# EAGLE design analog_rng2 (EAGLE 8.1.1)
True Random Number Generator
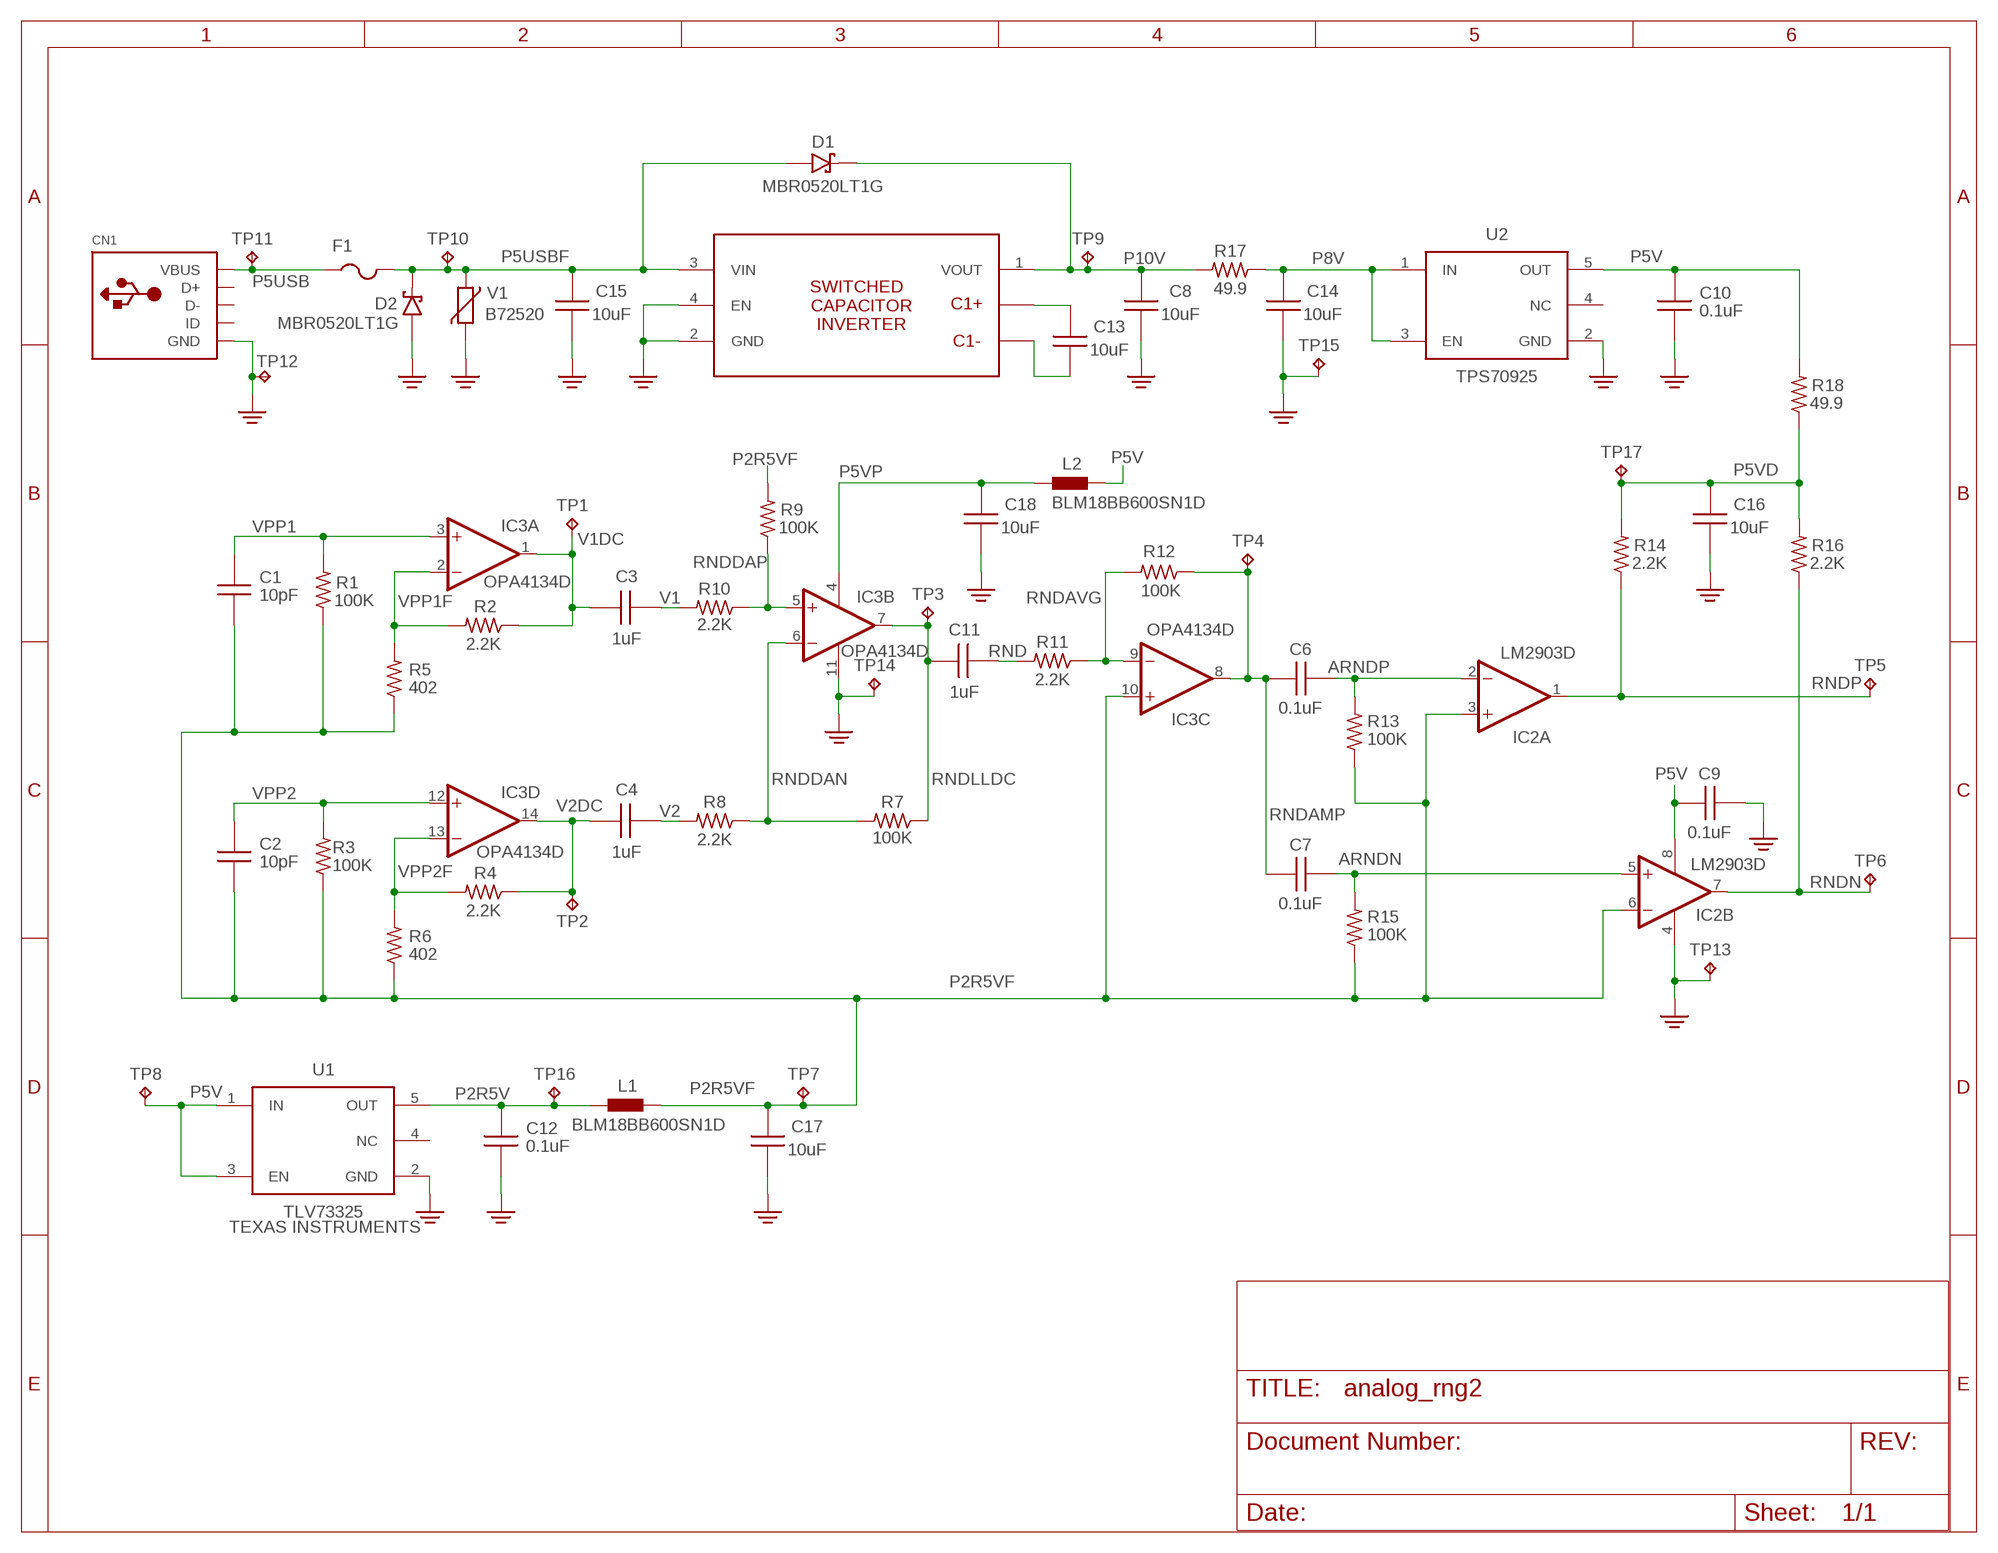
[diagram p0: schematic, sheet 1]

## Parts
C1  10pF  C-USC0603  [C0603]
C2  10pF  C-USC0603  [C0603]
C3  1uF  C-USC1206  [C1206]
C4  1uF  C-USC1206  [C1206]
C6  0.1uF  C-USC0603  [C0603]
C7  0.1uF  C-USC0603  [C0603]
C8  10uF  C-USC1206  [C1206]
C9  0.1uF  C-USC0603  [C0603]
C10  0.1uF  C-USC0603  [C0603]
C11  1uF  C-USC1206  [C1206]
C12  0.1uF  C-USC0603  [C0603]
C13  10uF  C-USC1206  [C1206]
C14  10uF  C-USC1206  [C1206]
C15  10uF  C-USC1206  [C1206]
C16  10uF  C-USC1206  [C1206]
C17  10uF  C-USC1206  [C1206]
C18  10uF  C-USC1206  [C1206]
CN1  USBMINIB  [USB-MINIB]
D1  MBR0520LT1G  MBR0520LT1GSOD-123  [SOD-123]
D2  MBR0520LT1G  MBR0520LT1GSOD-123  [SOD-123]
F1  PTCFUSE-1812  [1812]
IC2  LM2903D  [SO08]
IC3  OPA4134D  [SO14]
L1  BLM18BB600SN1D  BEADR0805  [R0805]
L2  BLM18BB600SN1D  BEADR0805  [R0805]
R1  100K  R-US_R1206  [R1206]
R2  2.2K  R-US_R1206  [R1206]
R3  100K  R-US_R1206  [R1206]
R4  2.2K  R-US_R1206  [R1206]
R5  402  R-US_R1206  [R1206]
R6  402  R-US_R1206  [R1206]
R7  100K  R-US_R1206  [R1206]
R8  2.2K  R-US_R1206  [R1206]
R9  100K  R-US_R1206  [R1206]
R10  2.2K  R-US_R1206  [R1206]
R11  2.2K  R-US_R1206  [R1206]
R12  100K  R-US_R1206  [R1206]
R13  100K  R-US_R1206  [R1206]
R14  2.2K  R-US_R1206  [R1206]
R15  100K  R-US_R1206  [R1206]
R16  2.2K  R-US_R1206  [R1206]
R17  49.9  R-US_R1206  [R1206]
R18  49.9  R-US_R1206  [R1206]
TP1  TPPAD1-20  [P1-20]
TP2  TPPAD1-20  [P1-20]
TP3  TPPAD1-20  [P1-20]
TP4  TPPAD1-20  [P1-20]
TP5  TPPAD1-20  [P1-20]
TP6  TPPAD1-20  [P1-20]
TP7  TPPAD1-20  [P1-20]
TP8  TPPAD1-20  [P1-20]
TP9  TPPAD1-20  [P1-20]
TP10  TPPAD1-20  [P1-20]
TP11  TPPAD1-20  [P1-20]
TP12  TPPAD1-20  [P1-20]
TP13  TPPAD1-20  [P1-20]
TP14  TPPAD1-20  [P1-20]
TP15  TPPAD1-20  [P1-20]
TP16  TPPAD1-20  [P1-20]
TP17  TPPAD1-20  [P1-20]
U1  TLV73325  [SOT23-5]
U2  TPS70925  [SOT23-5]
U23423  LM277625  [SOT23-6]
V1  B72520  VARISTORCN1206  [CT/CN1206]

## Nets
ARNDN: C7.2 IC2.5(B:+IN) R15.2
ARNDP: C6.2 IC2.2(A:-IN) R13.2
N$1: C13.1 U23423.5(C1P)
N$2: C13.2 U23423.6(C1N)
P2R5V: C12.1 L1.1 TP16.TP U1.5(OUT)
P2R5VF: C1.2 C2.2 C17.1 IC2.3(A:+IN) IC2.6(B:-IN) IC3.10(C:+IN) L1.2 R1.1 R3.1 R5.1 R6.1 R9.2 R13.1 R15.1 TP7.TP
P5USB: CN1.VBUS F1.1 TP11.TP
P5USBF: C15.1 D1.A D2.K F1.2 TP10.TP U23423.3(VIN) V1.1
P5V: C9.1 C10.1 IC2.8(P:V+) L2.2 R18.2 TP8.TP U1.1(IN) U1.3(EN) U2.5(OUT)
P5VD: C16.1 R14.2 R16.2 R18.1 TP17.TP
P5VP: C18.1 IC3.4(P:V+) L2.1
P8V: C14.1 R17.1 U2.1(IN) U2.3(EN)
P10V: C8.1 D1.K R17.2 TP9.TP U23423.1(VOUT)
PE: C8.2 C9.2 C10.2 C12.2 C14.2 C15.2 C16.2 C17.2 C18.2 CN1.GND D2.A IC2.4(P:V-) IC3.11(P:V-) TP12.TP TP13.TP TP14.TP TP15.TP U1.2(GND) U2.2(GND) U23423.2(GND) U23423.4(EN) V1.2
RND: C11.2 R11.2
RNDAMP: C6.1 C7.1 IC3.8(C:OUT) R12.1 TP4.TP
RNDAVG: IC3.9(C:-IN) R11.1 R12.2
RNDDAN: IC3.6(B:-IN) R7.2 R8.1
RNDDAP: IC3.5(B:+IN) R9.1 R10.1
RNDLLDC: C11.1 IC3.7(B:OUT) R7.1 TP3.TP
RNDN: IC2.7(B:OUT) R16.1 TP6.TP
RNDP: IC2.1(A:OUT) R14.1 TP5.TP
V1: C3.2 R10.2
V1DC: C3.1 IC3.1(A:OUT) R2.1 TP1.TP
V2: C4.2 R8.2
V2DC: C4.1 IC3.14(D:OUT) R4.1 TP2.TP
VPP1: C1.1 IC3.3(A:+IN) R1.2
VPP1F: IC3.2(A:-IN) R2.2 R5.2
VPP2: C2.1 IC3.12(D:+IN) R3.2
VPP2F: IC3.13(D:-IN) R4.2 R6.2
Unconnected: CN1.D+ CN1.D- CN1.ID U1.4(NC) U2.4(NC)

## Library data of the parts
C1-C4 C6-C18 = vreg_local:C-US: CAPACITOR, American symbol
CN1 = vreg_local:USB: USB Connectors USBMINIB - Surface Mount Female Mini-B USB Connector 4UConnector: 06564 By microbuilder.eu Thru-hole RA Female Mini-B USB Connector 4UConnector: 18732 By ladyada.net
D1 D2 = vreg_local:MBR0520LT1G: Schottky Diode
F1 = vreg_local:PTCFUSE: PTC fuses, resettable thermistors
IC2 = linear:LM2903: COMPARATOR
IC3 = vreg_local:OPA4134: OP Amp, Low Noise Audio; MF: TEXAS INSTRUMENTS; MPN: OPA4134UA/2K5; OC_DIGIKEY: 296-26284-1-ND
L1 L2 = vreg_local:BEAD: Ferrite Bead
R1-R18 = resistor:R-US_: RESISTOR, American symbol
TP1-TP17 = testpad:TP: Test pad
U1 = vreg_local:TLV733: Voltage Regulator 2.5 V, LDO, 300 mA Source: http://www.ti.com/lit/ds/symlink/tlv733p.pdf; MF: TEXAS INSTRUMENTS; MPN: TLV73325PDBVT; OC_DIGIKEY: 296-38491-1-ND
U2 = vreg_local:TPS709: Voltage Regulator 5 V, LDO, 200 mA Source: http://www.ti.com/lit/ds/symlink/tps709.pdf; MF: TEXAS INSTRUMENTS; MPN: TLV70950DBVR; OC_DIGIKEY: 296-35484-1-ND
U23423 = vreg_local:LM2776: Switched Capacitor Inverter 2.7 to 5.5 V, 200 mA Source: LM2776 datasheet <http://www.ti.com/lit/ds/symlink/lm2776.pdf>; MF: TEXAS INSTRUMENTS; MPN: LM2776DBVR; OC_DIGIKEY: 296-43957-1-ND
V1 = vreg_local:VARISTOR: VARISTOR

## Board
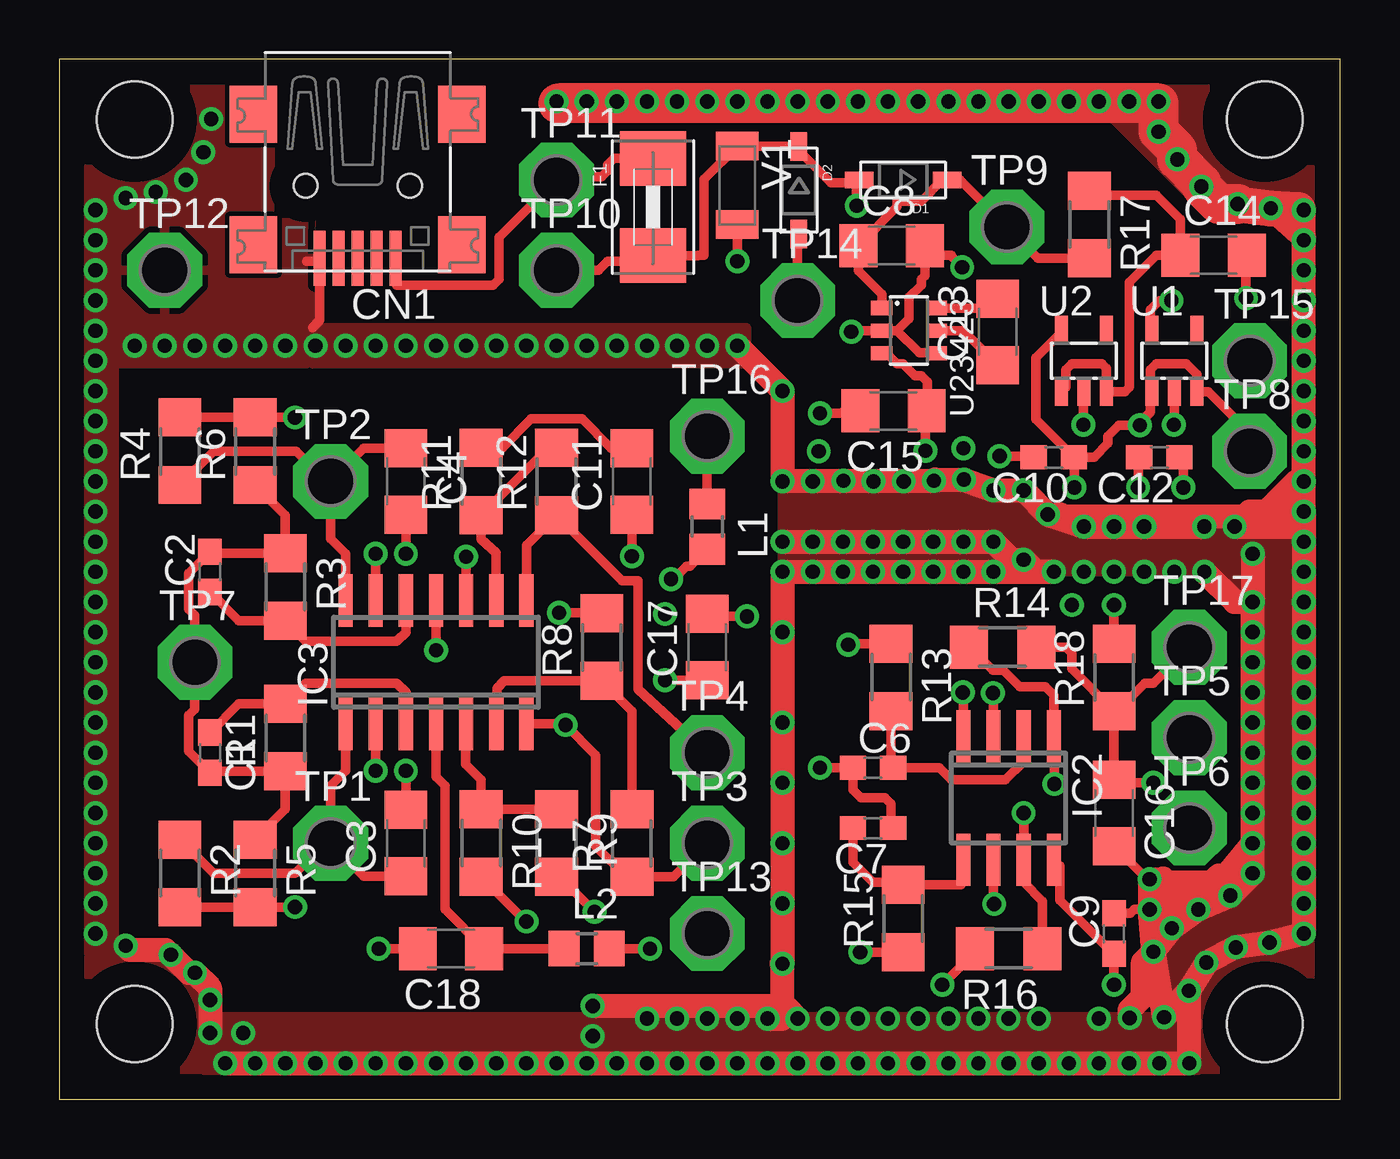
[diagram p1: board, top side]
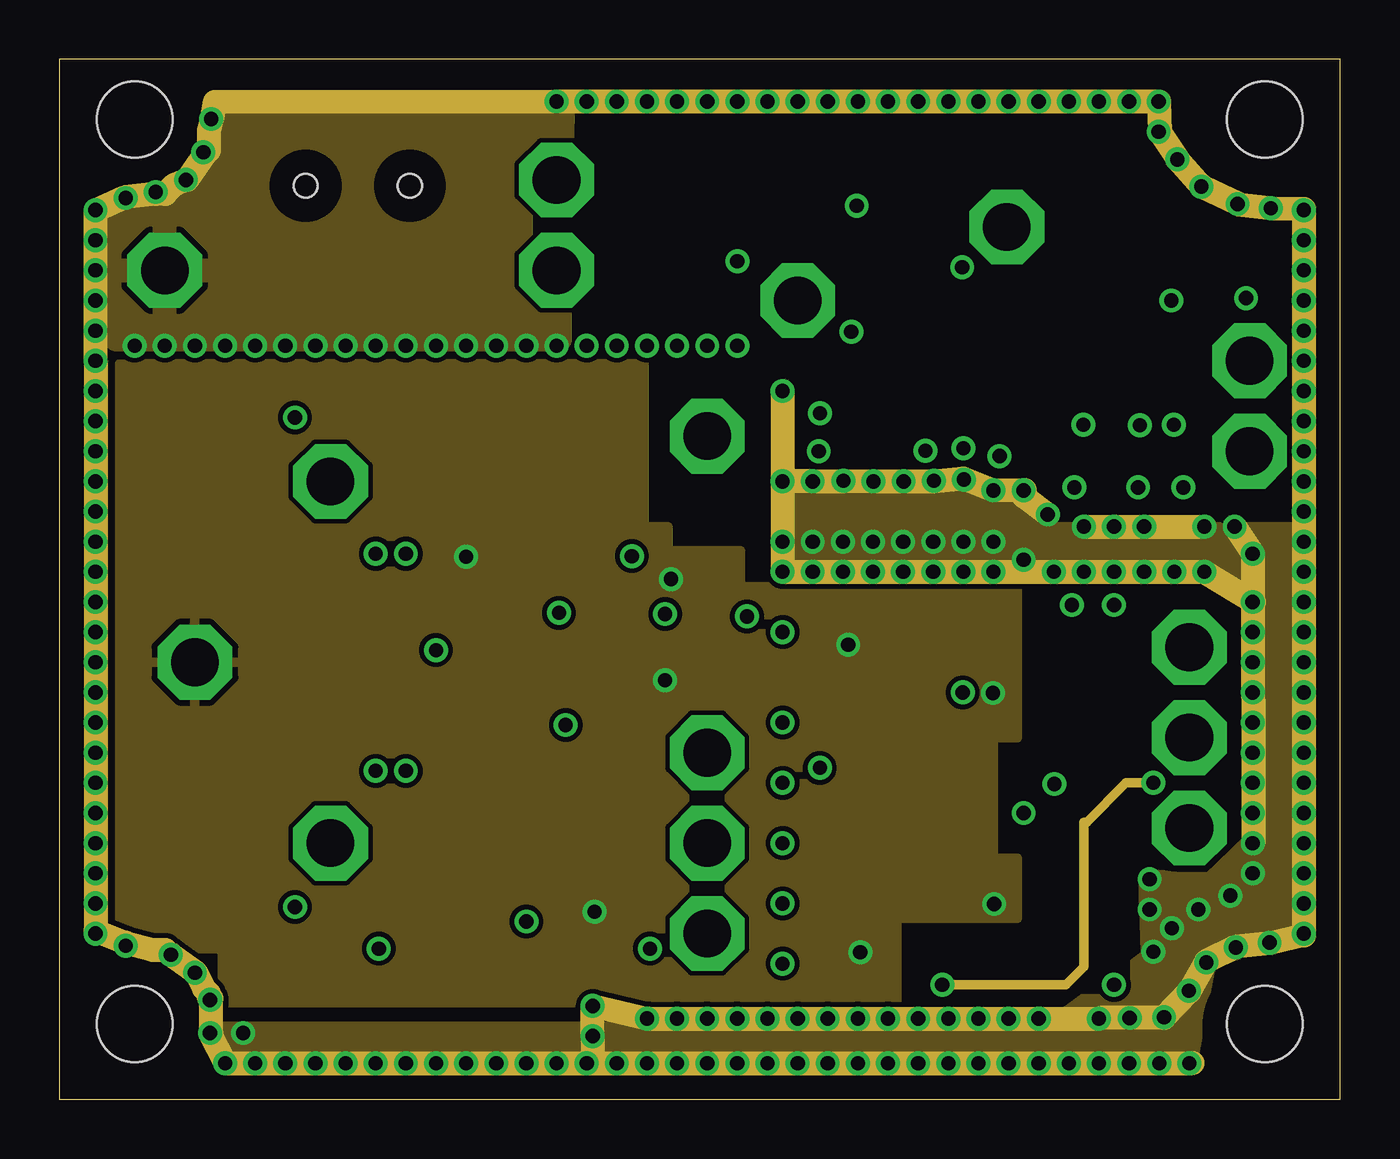
[diagram p2: board, inner layer Route2]
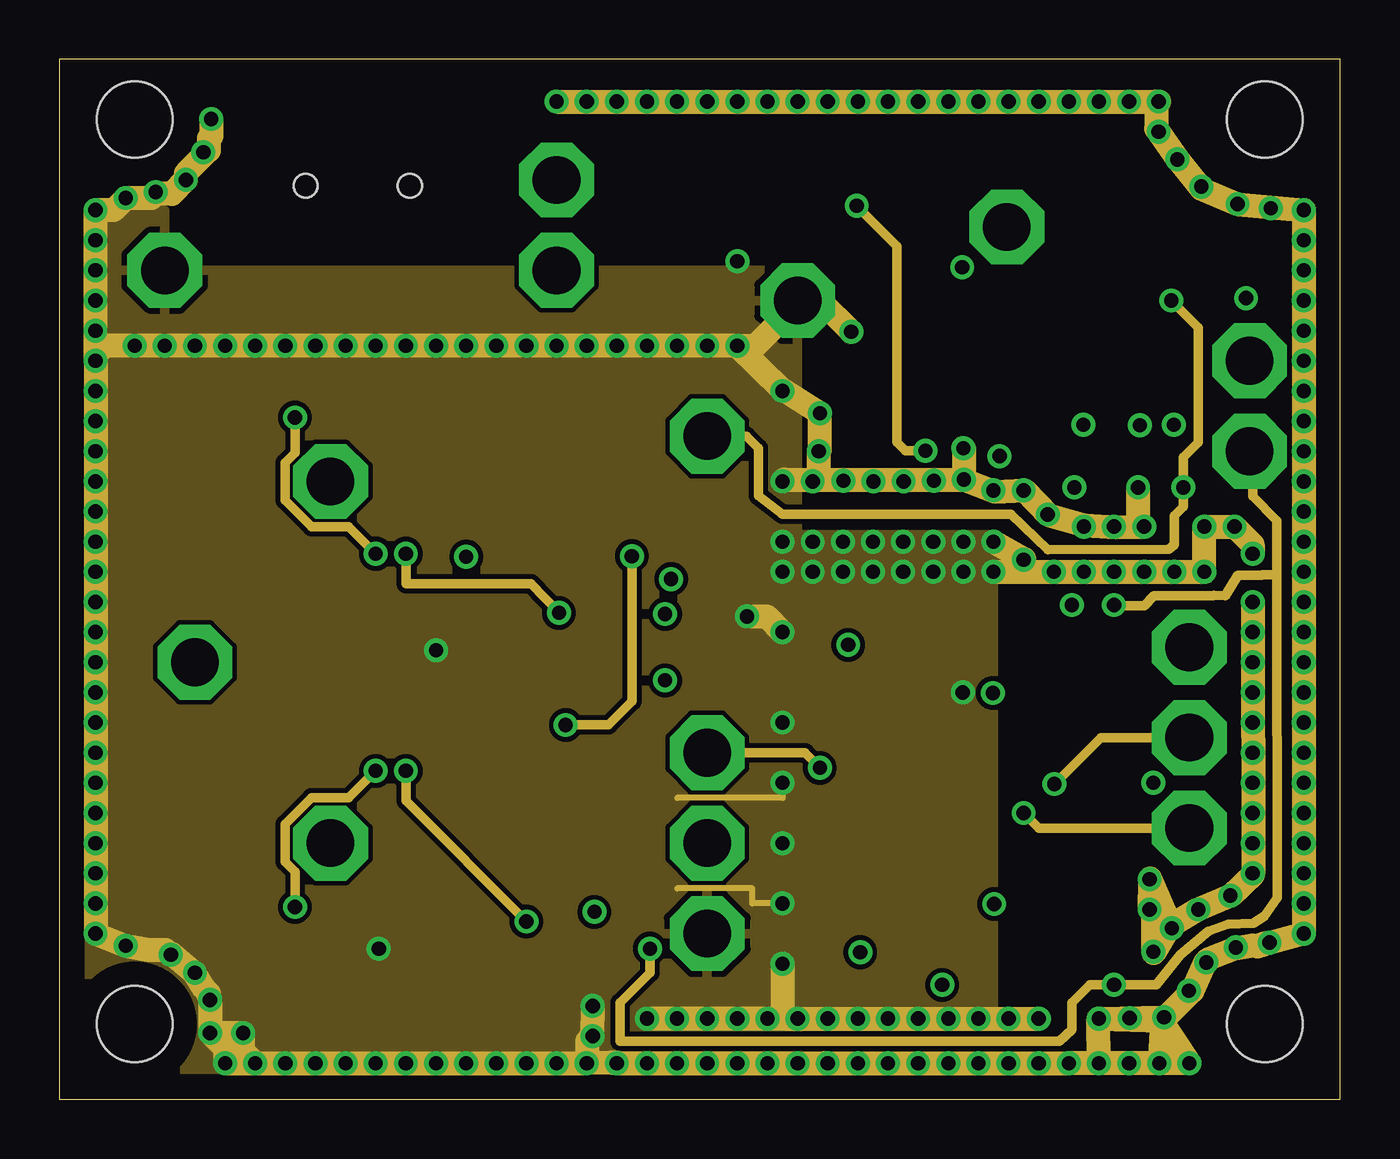
[diagram p3: board, inner layer Route15]
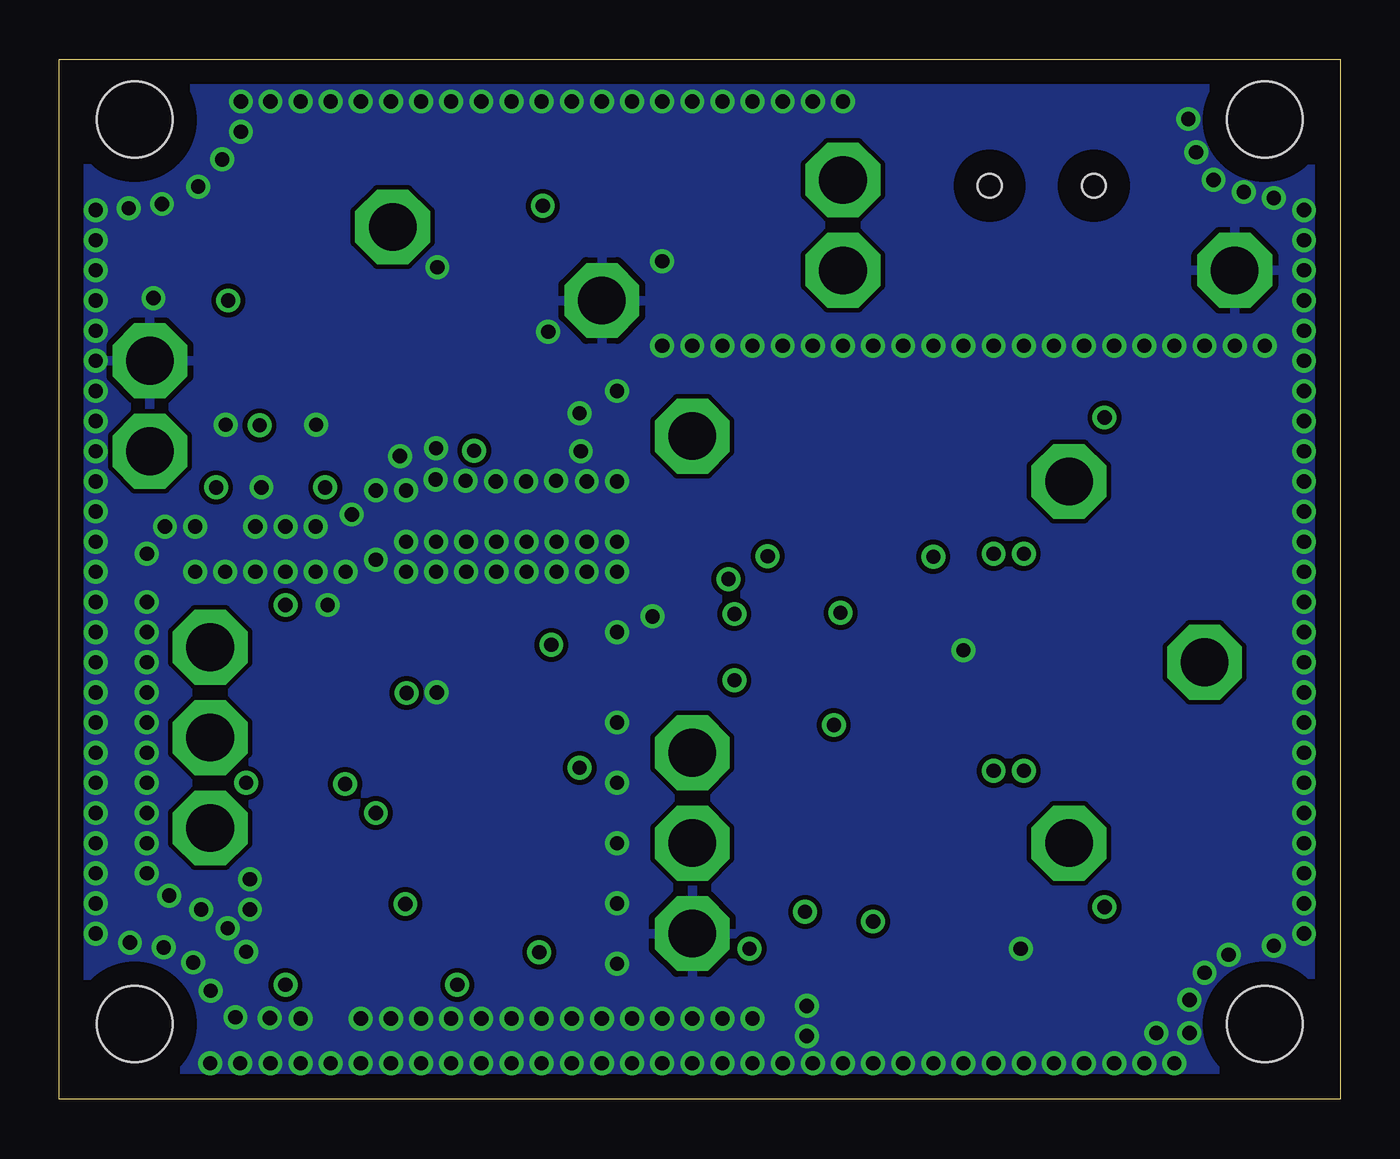
[diagram p4: board, bottom side, seen from below]

Size 53.98 x 43.82 mm. Coordinates in mm from the lower left corner, seen from the top.
Outline: 0,0 53.98,0 53.98,43.81 0,43.81 0,0
Copper layers (1+2*15+16): Top 0.035mm / dielectric 0.21mm / Route2 0.035mm / dielectric 40mil / Route15 0.035mm / dielectric 0.21mm / Bottom 0.035mm
Design rules "default *": minimum track width 10mil, minimum drill 24mil, track to track 8mil, track to pad 8mil, pad to pad 8mil, via to via 8mil, smd to smd 8mil, copper to edge 40mil, drill to drill 8mil, minimum pad ring 10mil, minimum via ring 8mil, stop-mask expansion 4mil, vias tented up to drill 0mil, thermal gap 10mil
Holes 3.2 mm at 3.17,3.17 3.17,41.27 50.8,41.27 50.8,3.17

### Footprints (pad centres in the part's own frame; a part is rotated, then mirrored left to right if it is on the bottom)
C0603 = smd 1.1 x 1: 1 -0.85,0; 2 0.85,0
C1206 = smd 1.6 x 1.8: 1 -1.4,0; 2 1.4,0
USB-MINIB = smd 0.5 x 2.308: D+ -0.8,4.064; D- 0,4.064; GND 1.6,4.064; ID 0.8,4.064; VBUS -1.6,4.064 | smd 2 x 2.4: GND1 -4.4,-2; GND2 -4.4,3.5; GND3 4.4,3.5; GND4 4.4,-2 | hole 1: -2.2,1; 2.2,1
SOD-123 = smd 1.2 x 0.7: A 1.85,0; K -1.85,0
1812 = smd 2.286 x 2.794: 1 -2.046,0; 2 2.046,0
SO08 = smd 0.6 x 2.2: 1 -1.905,-2.6; 2 -0.635,-2.6; 3 0.635,-2.6; 4 1.905,-2.6; 5 1.905,2.6; 6 0.635,2.6; 7 -0.635,2.6; 8 -1.905,2.6
SO14 = smd 0.6 x 2.2: 1 -3.81,-2.6; 2 -2.54,-2.6; 3 -1.27,-2.6; 4 0,-2.6; 5 1.27,-2.6; 6 2.54,-2.6; 7 3.81,-2.6; 8 3.81,2.6; 9 2.54,2.6; 10 1.27,2.6; 11 0,2.6; 12 -1.27,2.6; 13 -2.54,2.6; 14 -3.81,2.6
R0805 = smd 1.3 x 1.5: 1 -0.95,0; 2 0.95,0
R1206 = smd 1.6 x 1.803: 1 -1.422,0; 2 1.422,0
P1-20 = drill 2.007 pad 3.15 octagon: TP 0,0
SOT23-5 = smd 0.55 x 1.2: 1 -0.95,-1.3; 2 0,-1.3; 3 0.95,-1.3; 4 0.95,1.3; 5 -0.95,1.3
SOT23-6 = smd 0.6 x 0.9: 1 -0.95,-1.15; 2 0,-1.15; 3 0.95,-1.15; 4 0.95,1.15; 5 0,1.15; 6 -0.95,1.15
CT/CN1206 = smd 1.2 x 1.8: 1 -1.65,0; 2 1.65,0

### Placement (x,y rotation side)
C1  6.35,14.61 270 top
C2  6.35,22.23 90 top
C3  14.61,10.79 90 top
C4  14.61,26.04 270 top
C6  34.29,13.97 0 top
C7  34.29,11.43 180 top
C8  35.08,35.97 0 top
C9  44.45,6.99 90 top
C10  41.91,27.05 180 top
C11  24.13,26.04 90 top
C12  46.35,27.05 180 top
C13  39.55,32.33 90 top
C14  48.64,35.56 0 top
C15  35.15,29.01 180 top
C16  44.45,12.06 270 top
C17  27.3,19.05 90 top
C18  16.51,6.35 180 top
CN1  12.57,39.5 180 top
D1  35.56,38.73 180 top
D2  31.17,38.3 270 top
F1  25.02,37.59 270 top
IC2  40.01,12.7 180 top
IC3  15.88,18.41 0 top
L1  27.3,24.13 270 top
L2  22.23,6.35 0 top
R1  9.53,15.24 90 top
R2  5.08,9.53 270 top
R3  9.53,21.59 270 top
R4  5.08,27.3 90 top
R5  8.26,9.53 270 top
R6  8.26,27.3 90 top
R7  24.13,10.79 90 top
R8  22.86,19.05 90 top
R9  20.95,10.79 270 top
R10  17.78,10.79 270 top
R11  17.78,26.04 90 top
R12  20.95,26.04 90 top
R13  35.05,17.78 270 top
R14  39.75,19.05 0 top
R15  35.56,7.62 90 top
R16  40.01,6.35 180 top
R17  43.41,36.86 270 top
R18  44.45,17.78 90 top
TP1  11.43,10.79 0 top
TP2  11.43,26.04 0 top
TP3  27.3,10.79 0 top
TP4  27.3,14.61 0 top
TP5  47.62,15.24 0 top
TP6  47.62,11.43 0 top
TP7  5.71,18.41 0 top
TP8  50.16,27.3 0 top
TP9  39.93,36.75 0 top
TP10  20.95,34.92 0 top
TP11  20.95,38.73 0 top
TP12  4.45,34.92 0 top
TP13  27.3,6.99 0 top
TP14  31.11,33.66 0 top
TP15  50.16,31.11 0 top
TP16  27.3,27.94 0 top
TP17  47.62,19.05 0 top
U1  46.99,31.11 0 top
U2  43.18,31.11 0 top
U23423  35.81,32.38 270 top
V1  28.57,38.51 270 top

### Tracks (layer width: path | path; a pad name or v marks a point on that pad's centre or on a via)
ARNDN
  Top 0.406: C7.2 33.44,9.99 34.29,9.14 35.46,9.14 R15.2 38,9.04 38.1,9.14 IC2.5
ARNDP
  Top 0.406: R13.2 35.05,13.97 C6.2 37.08,13.97 37.59,13.46 39.88,13.46 40.64,14.22 IC2.2
N$1
  Top 0.406: U23423.5 38.1,32.38 C13.1
N$2
  Top 0.406: U23423.6 39.15,33.34 C13.2
N$173  (via drill 0.6)
  other vias: 25.53,20.45
P2R5V  (via drill 0.6)
  Top 0.406: U1.5 45.97,32.48 45.97,33.27 46.35,33.66 v46.86,33.66 | C12.1 47.37,26.89 v47.37,25.78 | TP16.TP L1.1
  Route15 0.406: v46.86,33.66 48.01,32.51 48.01,27.69 47.37,27.05 v47.37,25.78 47.37,24.97 46.99,24.59 46.99,23.37 46.76,23.18 41.66,23.16 40.11,24.66 30.48,24.66 29.46,25.42 29.46,27.43 28.96,27.94 TP16.TP
P2R5VF  (via drill 0.6)
  Top 0.406: R6.1 9.53,24.61 R3.1 6.41,23.01 C2.2 5.44,22.17 5.44,20.66 5.71,20.39 TP7.TP 5.71,16.45 5.44,16.17 5.44,14.66 C1.2 6.41,13.82 R1.1 9.53,12.22 R5.1 | IC3.10 v17.14,22.86 | IC2.3 39.37,17.09 v39.34,17.12 | R13.1 33.3,19.2 v33.25,19.15 | IC2.6 39.37,8.26 v39.4,8.23 | R15.1 v33.76,6.2 | v33.76,6.2 | L1.2 26.58,22.45 26.44,22.45 25.91,21.92 v25.78,21.92 | v22.55,7.9 21.08,9.37 R9.2 | C17.1 v25.53,17.65
  pour Route2: 25.65,23.11 28.7,23.11 28.7,21.59 40.39,21.59 40.39,15.24 39.37,15.24 39.37,10.16 40.39,10.16 40.39,7.62 35.31,7.62 35.31,4.06 6.86,4.06 6.86,6.35 2.54,6.35 2.54,28.96 2.54,30.99 24.64,30.99 24.64,24.13 25.65,24.13
P5USB
  Top 0.406: CN1.VBUS 14.22,35.69 14.22,34.29 18.29,34.29 18.54,34.54 18.54,36.32 TP11.TP 21.08,38.86 22.86,38.86 23.11,39.12 23.11,39.37 23.38,39.64 F1.1
P5USBF  (via drill 0.6)
  Top 0.406: TP10.TP 22.73,34.92 23.11,35.31 24.78,35.31 F1.2 26.91,35.55 26.92,35.56 27.18,35.56 27.18,38.76 V1.1 D2.K 31.17,39.95 32.51,38.61 33.58,38.61 D1.A 33.6,38.63 v33.6,37.64 | U23423.3 34.86,31.43 35.31,30.99 35.56,30.99 36.07,30.48 36.32,30.48 36.58,30.23 36.58,29.03 C15.1 36.5,28.95 v36.5,27.33
  Route15 0.406: v33.6,37.64 35.31,35.94 35.31,27.69 35.66,27.33 v36.5,27.33
P5V  (via drill 0.6)
  Top 0.406: C10.1 41.15,28.66 41.15,31.24 42.23,32.32 U2.5 | C10.1 42.77,27.04 v42.77,25.78 | C10.1 42.89,26.92 42.93,26.92 | C10.1 43.61,27.05 44.2,27.64 44.2,27.94 44.65,28.4 v45.54,28.4 45.54,28.52 45.97,28.96 45.97,29.75 U1.1 45.97,29.82 45.97,30.73 46.23,30.99 47.5,30.99 47.94,30.55 U1.3 48.42,29.82 50.16,28.07 TP8.TP 50.29,27.18 | L2.2 v24.89,6.35 | v44.45,4.83 C9.1 44.41,6.13 42.16,8.38 42.16,9.85 IC2.8 | R18.2 v44.45,20.83
  Route15 0.406: TP8.TP 50.29,27.18 50.29,25.4 51.31,24.38 51.31,22.1 | 51.31,22.1 51.33,8.48 50.79,7.72 50.31,7.41 49.26,7.39 48.42,7.09 47.24,6.1 46.23,4.83 v44.45,4.83 43.43,4.83 42.67,4.06 42.67,2.94 42.14,2.46 23.62,2.46 23.62,4.06 24.89,5.33 v24.89,6.35 | v44.45,20.83 44.48,20.8 45.72,20.8 46.13,21.21 48.64,21.21 48.66,21.23 49.15,21.21 49.66,22.08 50.67,22.08 50.69,22.1 51.31,22.1
P5VD  (via drill 0.6)
  Top 0.406: R14.2 42.42,19.05 42.67,18.8 42.67,18.14 R18.1 | R18.1 C16.1 44.58,13.34 v46.1,13.34 | R18.1 44.58,16.36 45.74,17.53 46.1,17.53 TP17.TP | v37.21,4.83 38.58,6.2 R16.2
  Route2 0.406: v37.21,4.83 42.42,4.83 43.18,5.59 43.18,11.68 43.31,11.68 44.96,13.34 v46.1,13.34
P5VP
  Top 0.406: L2.1 C18.1 16.26,8 16.26,13.21 15.88,13.59 IC3.4
P8V
  Top 0.406: R17.1 43.59,38.1 46.23,38.1 47.24,37.08 47.24,36.83 C14.1 46.23,35.56 45.09,34.42 45.09,30 44.9,29.82 U2.3 44.13,30.8 43.94,30.99 42.67,30.99 42.42,30.73 42.42,30 U2.1
P10V
  Top 0.406: U23423.1 34.66,33.92 33.68,34.9 C8.1 35.31,37.59 35.31,37.85 36.32,37.85 37.21,38.73 D1.K 37.95,38.73 TP9.TP 41.25,35.43 R17.2
PE  (via drill 0.6)
  Top 0.406: 35.31,32.38 U23423.2 33.43,32.38 v33.38,32.33 | 35.31,32.38 36.25,31.45 36.95,31.45 U23423.4 | 35.31,32.38 35.81,32.89 35.81,33.78 36.32,34.29 36.32,34.54 36.48,34.7 C8.2 | V1.2 v28.57,35.31 | C15.2 33.1,29.01 32.99,28.91 v32.05,28.91 | C10.2 41.01,27.1 v39.62,27.1 | C12.2 45.48,27.03 v45.47,25.78 | U2.2 43.16,29.79 v43.16,28.42 | v46.97,28.42 46.99,28.45 U1.2 | 10.41,35.31 10.85,35.31 CN1.GND 10.97,32.82 10.67,32.51 | C8.2 36.63,35.81 | v38.05,35.05 37.59,35.51 37.59,35.56 37.08,35.56 36.68,35.97 C8.2 | D2.A 31.11,36.4 TP14.TP | IC3.11 v15.88,18.92 | IC2.4 38.1,17.12 v38.08,17.14 | C9.2 45.15,7.83 45.31,8 v45.95,8 | C16.2 45.84,9.27 v45.95,9.27 | C17.2 27.41,20.34 v28.98,20.34 | C14.2 50.01,35.53 v50.01,33.76 | C18.2 v13.46,6.35
  Top 1.016: v29.84,3.4 29.84,3.38 30.45,3.38 30.45,5.71 v30.48,5.71 v30.48,13.34 v30.48,15.88 v30.48,19.68 v30.48,22.23 v39.37,22.23 v41.91,22.23 41.15,22.23 v40.64,22.73 40.13,22.73 v39.37,23.5 v30.48,23.5 | v52.45,24.77 52.45,36.3 | v52.45,24.77 52.45,24.13 | 52.45,36.3 v52.45,37.47 | 52.45,24.13 v52.45,6.99 v51,6.6 v49.58,6.4 v48.34,5.77 v47.6,4.57 | v47.6,4.57 v46.56,3.45 v46.1,6.22 | v6.99,1.52 v31.11,1.52 v47.62,1.52 47.62,4.55 v47.6,4.57 | v2.79,6.48 2.97,6.3 4.47,6.3 4.67,6.1 v4.7,6.1 5.46,5.33 v5.71,5.33 6.35,4.7 v6.35,4.19 v6.35,2.79 | v48.26,22.23 49.53,20.95 v50.29,20.95 | 30.5,26.06 v30.48,26.04 | 30.5,26.06 v36.85,26.06 36.91,26.11 v38.12,26.11 v39.37,25.65 v40.64,25.65 v41.66,24.64 | v48.26,24.13 v45.72,24.13 v43.18,24.13 v41.66,24.64 | v50.29,22.99 v50.29,20.95 | v20.95,42.04 v46.33,42.04 | 30.5,26.06 30.48,26.09 v30.48,29.84 v28.57,31.75 | v50.29,9.53 v50.29,20.95 | v50.29,9.53 v49.35,8.59 v48.01,8 | v48.01,8 v46.89,7.21 | v46.1,6.22 v46.89,7.21 | v46.1,6.22 v45.95,8 | v46.89,7.21 v45.95,8 | v45.95,9.27 v45.95,8 | 50.24,24.13 v49.53,24.13 50.16,24.77 v52.45,24.77 | 50.24,24.13 52.45,24.13 | v45.95,8 v48.01,8 | v45.95,9.27 v48.01,8 | v45.95,9.27 46.52,9.3 46.68,9.14 48.57,9.14 48.87,9.44 v50.29,9.53 | v50.29,10.79 v48.01,8 | v51.05,37.54 52.45,36.3 | v52.45,26.04 52.15,26.04 50.24,24.13 | v41.66,24.64 42.2,24.64 42.27,24.57 52.25,24.57 v52.45,24.77 | v45.11,3.43 45.11,3.77 45.66,4.32 45.66,5.79 v46.1,6.22 | v22.48,3.94 30.35,3.94 30.48,3.81 30.71,3.81 v31.11,3.4
  Top 1.524: v49.66,37.72 v51.05,37.54 52.2,37.48
  Top 1.676: v49.66,37.72 48.87,37.72 v48.13,38.46 48.13,38.58 v47.12,39.6 47.12,39.98 v46.33,40.77 46.33,41.96 21.03,41.96
  Route2 1.016: 7.01,1.52 v6.99,1.52 | 7.01,1.52 47.75,1.52 | 22.48,1.57 v22.48,2.67 v22.48,3.94 24.79,3.4 41.3,3.4 | v52.45,37.47 52.46,34.22 52.46,6.91 51.03,6.58 49.58,6.43 48.34,5.82 47.62,4.55 46.56,3.43 43.87,3.43 | 46.35,42.04 v20.95,42.04 6.55,42.01 6.43,41.3 6.3,40.75 | v46.33,42.04 46.38,40.77 46.38,40.74 | 46.38,40.74 47.14,39.6 v47.12,39.6 48.11,38.48 48.18,38.46 49.66,37.74 v49.66,37.72 51.13,37.54 52.46,37.52 | v30.48,26.04 v31.75,26.04 33.02,26.04 | v33.05,26.06 34.29,26.04 36.83,26.04 38.1,26.16 v39.37,25.65 40.69,25.68 40.64,25.4 41.68,24.64 | v48.26,24.13 44.48,24.13 v44.45,24.13 v43.18,24.13 | v6.4,41.3 6.3,40.83 6.3,40.75 | v6.35,4.19 6.3,4.29 6.3,4.47 6.1,4.67 5.74,5.36 4.72,6.1 4.65,6.12 4.47,6.3 3.95,6.3 2.79,6.6 1.52,7.11 v1.52,31.11 1.52,37.44 2.77,38 4.06,38.15 4.47,38.15 4.85,38.53 5.38,38.73 6.15,39.83 6.3,39.98 6.3,40.75 | 7.01,1.52 v6.35,2.79 6.4,2.79 6.4,4.24 | 46.38,40.74 46.35,40.74 | v30.48,29.84 v30.48,26.04 | v30.48,26.04 v30.48,22.23 v41.91,22.23 v48.26,22.23 50.34,20.95 | v49.53,24.13 v50.29,22.99 50.32,10.77 | v41.27,3.4 43.84,3.4
  Route15 0.254: v30.48,13.34 30.48,12.7 26.04,12.7 | v30.48,8.26 29.21,8.26 29.21,8.89 26.04,8.89
  Route15 1.016: v20.95,42.04 46.23,42.04 | 46.35,42.04 46.23,42.04 | 46.23,42.04 46.23,40.89 47.12,39.62 48.13,38.35 v49.66,37.72 v52.45,37.47 52.46,37.19 52.46,30.99 v52.45,29.84 v52.45,6.99 51.05,6.6 | v51,6.6 50.77,6.56 50.71,6.51 50.59,6.5 50.49,6.44 50.29,6.48 49.53,6.35 48.45,5.92 48.3,5.79 47.75,4.57 46.48,3.3 v43.81,3.4 | 46.35,3.43 v47.62,1.52 v42.55,1.52 | 46.48,3.43 v46.35,1.52 | 22.1,1.52 v6.99,1.52 6.99,2.16 v6.35,2.79 | v23.5,1.52 32.26,1.52 | v22.23,1.52 23.25,1.54 23.5,1.54 | 30.61,3.4 v24.77,3.4 | 30.61,3.4 v41.27,3.4 | v22.48,3.94 22.45,2.67 22.25,2.46 22.25,1.52 | v6.4,41.3 6.4,40.59 6.3,40.49 6.3,39.98 5.33,39.02 v5.33,38.73 4.75,38.15 4.06,38.15 3.89,37.97 v2.79,37.97 2.29,37.47 v1.52,37.47 v1.52,31.11 | v1.52,31.11 v1.52,6.99 v2.79,6.48 3.77,6.3 4.47,6.3 4.62,6.14 4.75,6.12 5.71,5.31 6.11,4.66 6.3,4.47 6.3,4.34 6.38,4.22 | v6.35,4.19 v6.35,2.79 | v6.35,2.79 v7.75,2.79 7.75,2.03 v8.26,1.52 | v33.38,32.33 32.05,33.66 TP14.TP 31.11,33.53 29.34,31.75 v28.57,31.75 v3.17,31.75 1.91,31.75 1.52,31.37 v1.52,31.11 | v30.48,26.04 30.56,26.11 v38.12,26.11 | v38.1,27.43 38.12,27.41 v38.12,26.11 | v31.75,26.04 32,26.29 v32,27.3 32.05,27.36 v32.05,28.91 30.56,29.84 30.48,29.87 28.55,31.75 | v45.47,25.78 45.47,24.38 v45.72,24.13 44.53,24.11 43.2,24.18 41.71,24.61 40.69,25.65 39.42,25.6 v38.12,26.11 | v45.72,22.23 v46.99,22.23 v48.26,22.23 v48.26,24.13 v49.53,24.13 50.29,23.37 v50.29,22.99 | v46.1,6.22 46.1,7.87 45.97,8 | v32.38,1.52 v42.55,1.52 | v28.98,20.34 29.82,20.34 v30.48,19.68 | v30.48,5.71 30.48,3.53 30.61,3.4 | v50.29,20.95 50.32,9.47 49.38,8.59 47.93,7.98 46.79,7.26 46.13,6.17
  Route15 1.016: v45.95,8 45.97,9.27 | v46.89,7.21 45.97,9.3 | v43.81,1.52 43.79,3.4 v46.56,3.45 | v39.37,22.23 41.25,22.23 41.26,22.22 v45.72,22.22 | v39.37,23.5 40.66,22.76
  other vias: 4.06,38.23 1.52,36.2 1.52,34.92 1.52,33.66 1.52,32.38 5.71,31.75 4.45,31.75 6.99,31.75 8.26,31.75 9.53,31.75 10.79,31.75 12.06,31.75 13.34,31.75 14.61,31.75 15.88,31.75 17.14,31.75 18.41,31.75 19.68,31.75 20.95,31.75 22.23,31.75 23.5,31.75 24.77,31.75 26.04,31.75 27.3,31.75 1.52,29.84 1.52,28.57 1.52,27.3 1.52,26.04 1.52,24.77 1.52,23.5 1.52,22.23 1.52,20.95 1.52,19.68 1.52,18.41 1.52,17.14 1.52,15.88 1.52,14.61 1.52,13.34 1.52,12.06 1.52,10.79 1.52,9.53 1.52,8.26 6.07,39.9 22.23,42.04 23.5,42.04 24.77,42.04 26.04,42.04 27.3,42.04 28.57,42.04 29.84,42.04 31.11,42.04 32.38,42.04 33.66,42.04 34.92,42.04 36.2,42.04 37.47,42.04 38.73,42.04 40.01,42.04 41.27,42.04 42.55,42.04 43.81,42.04 45.09,42.04 52.45,36.2 52.45,34.92 52.45,33.66 52.45,32.38 52.45,28.57 52.45,31.11 52.45,27.3 52.45,23.5 52.45,22.23 52.45,20.95 52.45,19.68 52.45,18.41 52.45,17.14 52.45,15.88 50.29,19.68 50.29,18.41 50.29,17.14 50.29,15.88 50.29,14.61 50.29,13.34 50.29,12.06 52.45,14.61 52.45,13.34 52.45,12.06 52.45,10.79 52.45,9.53 52.45,8.26 41.27,1.52 9.53,1.52 10.79,1.52 12.06,1.52 13.34,1.52 14.61,1.52 15.88,1.52 17.14,1.52 18.41,1.52 19.68,1.52 20.95,1.52 24.77,1.52 26.04,1.52 27.3,1.52 28.57,1.52 29.84,1.52 33.66,1.52 34.92,1.52 36.2,1.52 38.73,1.52 40.01,1.52 26.04,3.4 27.3,3.4 28.57,3.4 32.38,3.4 33.66,3.4 34.92,3.4 36.2,3.4 37.47,3.4 38.73,3.4 40.01,3.4 42.67,20.83 34.32,26.04 35.59,26.04 31.75,23.5 33.02,23.5 34.29,23.5 35.56,23.5 36.83,23.5 38.1,23.5 43.18,22.23 44.45,22.23 37.47,1.52 45.09,1.52 31.75,22.23 33.02,22.23 34.29,22.23 35.56,22.23 36.83,22.23 38.1,22.23 30.48,10.79
  pour Top: 1.02,39.12 10.67,39.12 10.41,30.99 0.76,30.99
  pour Top: 10.67,30.99 28.96,30.99 28.96,32.51 10.67,32.51
  pour Top: 1.19,30.91 1.19,6.25 1.22,6.22 2.06,6.22 2.31,6.48 2.31,30.91
  pour Bottom: 1.27,1.27 1.27,42.67 52.83,42.67 53.09,42.67 53.09,1.27
  pour Top: 48.01,3.56 48.01,1.14 6.1,1.14 6.1,1.27 6.1,3.56
  pour Route2: 50.32,9.53 49.38,8.59 48.01,8 46.91,7.21 46.08,6.22 45.97,9.25 46.99,9.09 48.59,9.09 50.34,10.77 50.29,9.53
  pour Route2: 1.52,32.38 1.52,37.08 4.83,38.1 6.6,39.88 7.24,41.91 21.21,41.91 21.08,32 2.41,32
  pour Route2: 6.35,2.79 41.66,2.79 44.45,4.83 45.21,5.33 46.23,6.1 50.29,9.4 49.53,6.35 48.26,5.84 47.5,1.78 7.37,1.78
  pour Top: 30.48,26.04 38.1,26.04 38.48,25.65 40.51,25.65 42.16,24.13 49.53,24.13 50.29,22.99 50.29,20.83 49.53,20.95 48.26,22.23 30.48,22.23
  pour Top: 49.53,24.13 52.07,24.13 52.07,6.99 50.16,6.99 48.26,5.71 46.99,3.81 46.35,6.35 48.9,8.26 50.8,9.53 50.8,22.86
  pour Top: 1.27,42.55 8.89,42.55 8.89,38.1 1.27,38.1
  pour Top: 1.27,1.27 6.35,1.27 6.35,4.45 4.45,6.35 1.27,6.35
  pour Top: 52.7,1.27 47.62,1.27 47.62,6.99 52.7,6.99
  pour Top: 52.7,42.55 52.7,37.47 48.26,37.47 44.45,41.27 44.45,42.55
  pour Route2: 30.48,26.04 38.73,26.04 39.37,25.4 40.64,25.4 41.91,24.13 43.18,24.13 48.9,24.13 50.16,22.86 50.16,20.95 48.9,22.23 48.26,22.23 30.48,22.23
  pour Route2: 49.53,24.13 52.07,24.13 52.07,6.99 50.16,6.99 50.16,23.5
  pour Route15: 30.48,23.5 39.37,23.5 39.37,22.23 30.48,22.23
  pour Route15: 4.45,34.92 31.11,34.92 31.11,1.27 1.27,1.27 1.27,37.47 4.45,37.47
  pour Route15: 39.37,22.23 39.37,3.17 29.84,3.17 29.84,22.23
  pour Top: 10.79,31.75 10.16,31.75 10.16,36.2 10.79,36.2
RND
  Top 0.406: C11.2 23.25,27.43 22.02,28.66 19.89,28.66 18.68,27.46 R11.2
RNDAMP  (via drill 0.6)
  Top 0.406: IC3.8 19.68,23.34 R12.1 23.72,21.84 24.38,21.84 24.38,17.27 TP4.TP | v32.05,13.97 C6.1 33.44,13.04 33.78,12.7 34.8,12.7 35.05,12.45 35.05,11.52 C7.1
  Route15 0.406: TP4.TP 31.42,14.61 v32.05,13.97
RNDAVG
  Top 0.406: IC3.9 18.41,23.04 17.78,23.6 R11.1 20.62,27.46 R12.2
RNDDAN
  Top 0.406: 18.41,15.09 IC3.6 18.44,15.84 18.44,17.32 18.75,17.63 R8.1 24.13,16.36 R7.2
RNDDAP
  Top 0.406: IC3.5 17.12,15.79 17.12,14.12 17.78,13.46 R10.1 R9.1
RNDLLDC  (via drill 0.6)
  Top 0.406: C11.1 v24.13,22.89 | TP3.TP 25.88,9.37 R7.1 23.9,9.37 22.61,10.67 22.61,14.5 v21.34,15.77 21.29,15.81 IC3.7
  Route15 0.406: v24.13,22.89 24.13,16.76 23.14,15.77 v21.34,15.77
RNDN  (via drill 0.6)
  Top 0.406: R16.1 41.43,8.36 40.64,9.14 IC2.7 | IC2.7 40.64,10.16 | IC2.7 v40.64,12.06
  Route15 0.406: v40.64,12.06 41.27,11.43 TP6.TP
RNDP  (via drill 0.6)
  Top 0.406: R14.1 38.38,19.05 39.34,18.09 39.78,18.09 40.49,17.37 41.55,17.37 41.91,17.02 IC2.1 41.94,15.28 v41.94,13.28
  Route15 0.406: v41.94,13.28 43.89,15.24 TP5.TP
V1  (via drill 0.6)
  Top 0.406: C3.2 v14.61,13.84 | R10.2 19.66,7.49 v19.68,7.49
  Route15 0.406: 14.61,12.95 v14.61,13.84 | 14.61,12.95 14.61,12.68 | 14.61,12.95 14.61,12.57 v19.68,7.49
V1DC
  Top 0.406: TP1.TP 11.43,13.21 12.06,13.84 IC3.1 | TP1.TP 12.83,9.39 C3.1 | R2.1 6.5,9.53 9.93,9.53 11.2,10.79 TP1.TP
V2  (via drill 0.6)
  Top 0.406: R8.2 22.84,20.5 v21.06,20.5 | C4.2 v14.61,22.99
  Route15 0.406: v14.61,22.99 14.61,21.72 19.89,21.72 v21.06,20.5
V2DC
  Top 0.406: TP2.TP 11.43,23.62 12.06,22.99 IC3.14 | TP2.TP 12.83,27.43 C4.1 | R4.1 6.5,27.3 9.98,27.3 11.25,26.04 TP2.TP
VPP1
  Top 0.406: C1.1 7.56,16.66 R1.2 10.39,17.53 14.22,17.53 14.61,17.14 IC3.3
VPP1F  (via drill 0.6)
  Top 0.406: R2.2 R5.2 | R5.2 | R5.2 v9.93,8.1 | IC3.2 v13.34,13.84
  Route15 0.406: v13.34,13.84 12.2,12.71 10.64,12.71 9.52,11.59 9.52,10 9.93,9.59 v9.93,8.1
VPP2
  Top 0.406: C2.1 7.56,20.17 R3.2 10.39,19.3 14.22,19.3 14.61,19.68 IC3.12
VPP2F  (via drill 0.6)
  Top 0.406: R4.2 R6.2 | IC3.13 v13.34,22.99 | R6.2 | R6.2 v9.93,28.73
  Route15 0.406: v13.34,22.99 12.2,24.12 10.64,24.12 9.52,25.24 9.52,26.83 9.93,27.24 v9.93,28.73